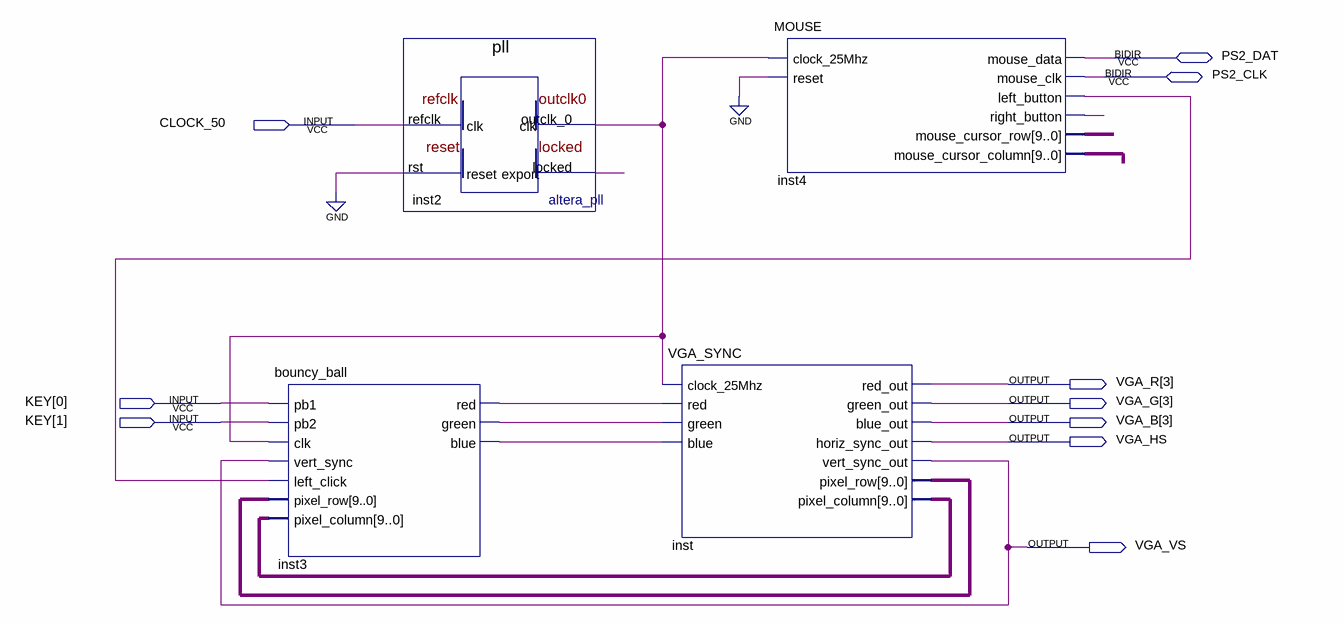
[diagram p0: schematic sheet]
// Quartus schematic backgroundcolourchangeexample.bdf as structural Verilog: 4 symbols, 10 pins
module backgroundcolourchangeexample (
  input  CLOCK_50,
  input  [1:0] KEY,
  inout  PS2_DAT,
  inout  PS2_CLK,
  output [3:3] VGA_R,
  output [3:3] VGA_G,
  output [3:3] VGA_B,
  output VGA_HS,
  output VGA_VS
);

  wire inst2_locked, inst2_outclk_0, inst3_blue, inst3_green, inst3_red, inst4_left_button,
       inst4_right_button;
  wire [9:0] inst4_mouse_cursor_column, inst4_mouse_cursor_row, inst_pixel_column, inst_pixel_row;

  bouncy_ball inst3 (
    .pb1(KEY[0]), .pb2(KEY[1]), .clk(inst2_outclk_0), .vert_sync(VGA_VS), .left_click(inst4_left_button),
    .pixel_row(inst_pixel_row), .pixel_column(inst_pixel_column), .red(inst3_red), .green(inst3_green),
    .blue(inst3_blue));
  pll inst2 (.refclk(CLOCK_50), .rst(1'b0), .outclk_0(inst2_outclk_0), .locked(inst2_locked));
  VGA_SYNC inst (
    .clock_25Mhz(inst2_outclk_0), .red(inst3_red), .green(inst3_green), .blue(inst3_blue),
    .red_out(VGA_R[3]), .green_out(VGA_G[3]), .blue_out(VGA_B[3]), .horiz_sync_out(VGA_HS),
    .vert_sync_out(VGA_VS), .pixel_row(inst_pixel_row), .pixel_column(inst_pixel_column));
  MOUSE inst4 (
    .clock_25Mhz(inst2_outclk_0), .reset(1'b0), .left_button(inst4_left_button),
    .right_button(inst4_right_button), .mouse_cursor_row(inst4_mouse_cursor_row),
    .mouse_cursor_column(inst4_mouse_cursor_column), .mouse_data(PS2_DAT), .mouse_clk(PS2_CLK));
endmodule
